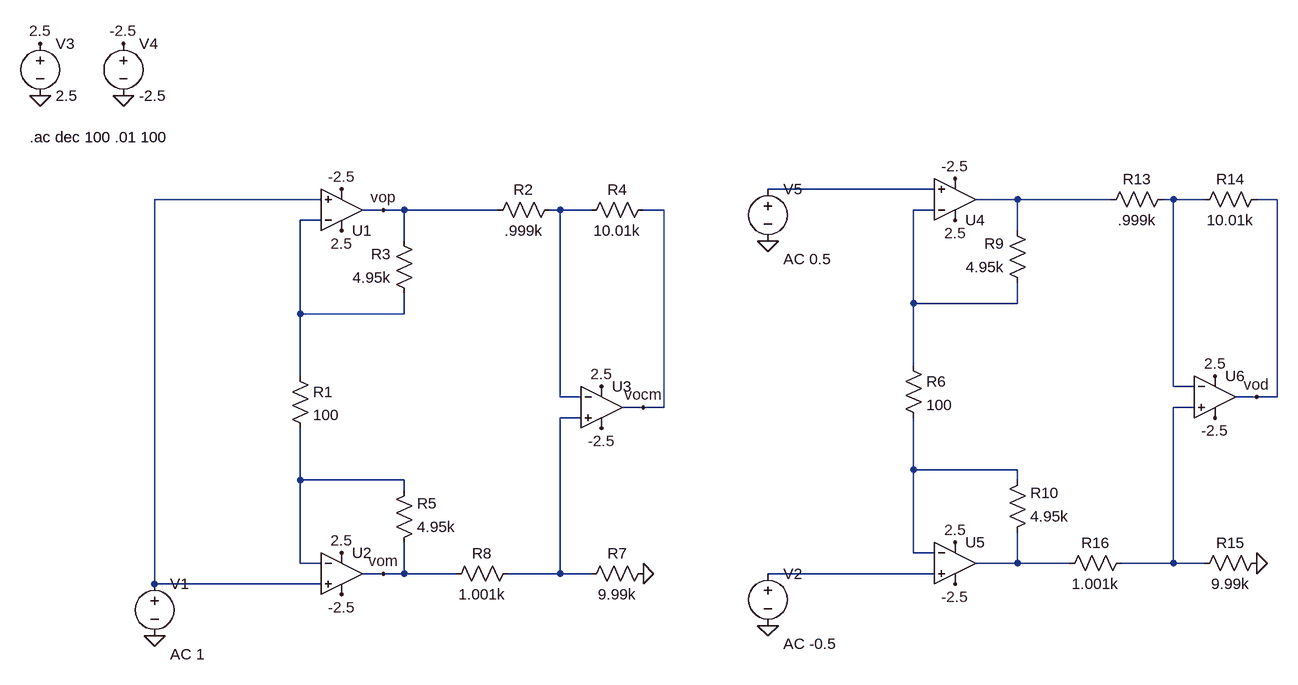
[diagram p0: schematic in_amp.asc]
in_amp.asc, the LTspice schematic file:
Version 4
SHEET 1 1708 880
WIRE 1168 128 912 128
WIRE 224 144 -32 144
WIRE 1296 144 1232 144
WIRE 1440 144 1296 144
WIRE 1536 144 1520 144
WIRE 1584 144 1536 144
WIRE 1696 144 1664 144
WIRE 320 160 288 160
WIRE 352 160 320 160
WIRE 496 160 352 160
WIRE 592 160 576 160
WIRE 640 160 592 160
WIRE 752 160 720 160
WIRE 1168 160 1136 160
WIRE 224 176 192 176
WIRE 1296 192 1296 144
WIRE 352 208 352 160
WIRE 1136 304 1136 160
WIRE 1296 304 1296 272
WIRE 1296 304 1136 304
WIRE 192 320 192 176
WIRE 352 320 352 288
WIRE 352 320 192 320
WIRE 1136 400 1136 304
WIRE 192 416 192 320
WIRE 1536 432 1536 144
WIRE 1568 432 1536 432
WIRE 592 448 592 160
WIRE 624 448 592 448
WIRE 1664 448 1632 448
WIRE 1696 448 1696 144
WIRE 1696 448 1664 448
WIRE 720 464 688 464
WIRE 752 464 752 160
WIRE 752 464 720 464
WIRE 1568 464 1536 464
WIRE 624 480 592 480
WIRE 1136 560 1136 480
WIRE 1296 560 1136 560
WIRE 192 576 192 496
WIRE 352 576 192 576
WIRE 1296 576 1296 560
WIRE 352 592 352 576
WIRE 1136 688 1136 560
WIRE 1168 688 1136 688
WIRE 192 704 192 576
WIRE 224 704 192 704
WIRE 1296 704 1296 656
WIRE 1296 704 1232 704
WIRE 1376 704 1296 704
WIRE 1536 704 1536 464
WIRE 1536 704 1456 704
WIRE 1584 704 1536 704
WIRE 320 720 288 720
WIRE 352 720 352 672
WIRE 352 720 320 720
WIRE 432 720 352 720
WIRE 592 720 592 480
WIRE 592 720 512 720
WIRE 640 720 592 720
WIRE 1168 720 912 720
WIRE -32 736 -32 144
WIRE 224 736 -32 736
FLAG -80 -16 0
FLAG -208 -16 0
FLAG -208 -96 2.5
FLAG -80 -96 -2.5
FLAG 256 192 2.5
FLAG 256 128 -2.5
FLAG 256 688 2.5
FLAG 256 752 -2.5
FLAG 320 160 vop
FLAG 320 720 vom
FLAG -32 816 0
FLAG 720 720 0
FLAG 656 432 2.5
FLAG 656 496 -2.5
FLAG 720 464 vocm
FLAG 1200 176 2.5
FLAG 1200 112 -2.5
FLAG 1200 672 2.5
FLAG 1200 736 -2.5
FLAG 912 800 0
FLAG 1664 704 0
FLAG 1600 416 2.5
FLAG 1600 480 -2.5
FLAG 1664 448 vod
FLAG 912 208 0
SYMBOL Opamps\\UniversalOpamp2 256 160 M180
SYMATTR InstName U1
SYMATTR SpiceModel level.1
SYMATTR Value2 Avol=10Meg GBW=1Meg Slew=10Meg
SYMBOL res 368 304 R180
WINDOW 0 36 76 Left 2
WINDOW 3 36 40 Left 2
SYMATTR InstName R3
SYMATTR Value 4.95k
SYMBOL voltage -208 -112 R0
WINDOW 123 0 0 Left 0
WINDOW 39 0 0 Left 0
SYMATTR InstName V3
SYMATTR Value 2.5
SYMBOL voltage -80 -112 R0
WINDOW 123 0 0 Left 0
WINDOW 39 0 0 Left 0
SYMATTR InstName V4
SYMATTR Value -2.5
SYMBOL Opamps\\UniversalOpamp2 256 720 R0
SYMATTR InstName U2
SYMATTR SpiceModel level.1
SYMATTR Value2 Avol=10Meg GBW=1Meg Slew=10Meg
SYMBOL res 336 688 M180
WINDOW 0 36 76 Left 2
WINDOW 3 36 40 Left 2
SYMATTR InstName R5
SYMATTR Value 4.95k
SYMBOL voltage -32 720 R0
WINDOW 123 24 124 Left 2
WINDOW 39 0 0 Left 0
SYMATTR Value2 AC 1
SYMATTR InstName V1
SYMATTR Value ""
SYMBOL Opamps\\UniversalOpamp2 656 464 R0
SYMATTR InstName U3
SYMATTR SpiceModel level.1
SYMATTR Value2 Avol=10Meg GBW=1Meg Slew=10Meg
SYMBOL res 592 144 R90
WINDOW 0 0 56 VBottom 2
WINDOW 3 32 56 VTop 2
SYMATTR InstName R2
SYMATTR Value .999k
SYMBOL res 736 144 R90
WINDOW 0 0 56 VBottom 2
WINDOW 3 32 56 VTop 2
SYMATTR InstName R4
SYMATTR Value 10.01k
SYMBOL res 736 704 R90
WINDOW 0 0 56 VBottom 2
WINDOW 3 32 56 VTop 2
SYMATTR InstName R7
SYMATTR Value 9.99k
SYMBOL res 416 736 R270
WINDOW 0 32 56 VTop 2
WINDOW 3 0 56 VBottom 2
SYMATTR InstName R8
SYMATTR Value 1.001k
SYMBOL Opamps\\UniversalOpamp2 1200 144 M180
SYMATTR InstName U4
SYMATTR SpiceModel level.1
SYMATTR Value2 Avol=10Meg GBW=1Meg Slew=10Meg
SYMBOL res 1312 288 R180
WINDOW 0 36 76 Left 2
WINDOW 3 36 40 Left 2
SYMATTR InstName R9
SYMATTR Value 4.95k
SYMBOL Opamps\\UniversalOpamp2 1200 704 R0
SYMATTR InstName U5
SYMATTR SpiceModel level.1
SYMATTR Value2 Avol=10Meg GBW=1Meg Slew=10Meg
SYMBOL res 1280 672 M180
WINDOW 0 36 76 Left 2
WINDOW 3 36 40 Left 2
SYMATTR InstName R10
SYMATTR Value 4.95k
SYMBOL voltage 912 704 R0
WINDOW 123 24 124 Left 2
WINDOW 39 0 0 Left 0
SYMATTR Value2 AC -0.5
SYMATTR InstName V2
SYMATTR Value ""
SYMBOL Opamps\\UniversalOpamp2 1600 448 R0
SYMATTR InstName U6
SYMATTR SpiceModel level.1
SYMATTR Value2 Avol=10Meg GBW=1Meg Slew=10Meg
SYMBOL res 1536 128 R90
WINDOW 0 0 56 VBottom 2
WINDOW 3 32 56 VTop 2
SYMATTR InstName R13
SYMATTR Value .999k
SYMBOL res 1680 128 R90
WINDOW 0 0 56 VBottom 2
WINDOW 3 32 56 VTop 2
SYMATTR InstName R14
SYMATTR Value 10.01k
SYMBOL res 1680 688 R90
WINDOW 0 0 56 VBottom 2
WINDOW 3 32 56 VTop 2
SYMATTR InstName R15
SYMATTR Value 9.99k
SYMBOL res 1360 720 R270
WINDOW 0 32 56 VTop 2
WINDOW 3 0 56 VBottom 2
SYMATTR InstName R16
SYMATTR Value 1.001k
SYMBOL voltage 912 112 R0
WINDOW 123 24 124 Left 2
WINDOW 39 0 0 Left 0
SYMATTR Value2 AC 0.5
SYMATTR InstName V5
SYMATTR Value ""
SYMBOL res 176 400 R0
SYMATTR InstName R1
SYMATTR Value 100
SYMBOL res 1120 384 R0
SYMATTR InstName R6
SYMATTR Value 100
TEXT -224 48 Left 2 !.ac dec 100 .01 100

The netlist it stands for:
* in_amp.asc
XU1 N002 N007 2.5 -2.5 vop level.1 Avol=10Meg GBW=1Meg Slew=10Meg ilimit=25m rail=0 Vos=0 phimargin=45 en=0 enk=0 in=0 ink=0 Rin=500Meg  ; pins IN+ IN- V+ V- OUT
R3 N007 vop 4.95k
V3 2.5 0 2.5
V4 -2.5 0 -2.5
XU2 N002 N011 2.5 -2.5 vom level.1 Avol=10Meg GBW=1Meg Slew=10Meg ilimit=25m rail=0 Vos=0 phimargin=45 en=0 enk=0 in=0 ink=0 Rin=500Meg  ; pins IN+ IN- V+ V- OUT
R5 vom N011 4.95k
V1 N002 0 AC 1
XU3 N009 N005 2.5 -2.5 vocm level.1 Avol=10Meg GBW=1Meg Slew=10Meg ilimit=25m rail=0 Vos=0 phimargin=45 en=0 enk=0 in=0 ink=0 Rin=500Meg  ; pins IN+ IN- V+ V- OUT
R2 N005 vop .999k
R4 vocm N005 10.01k
R7 0 N009 9.99k
R8 vom N009 1.001k
XU4 N001 N006 2.5 -2.5 N003 level.1 Avol=10Meg GBW=1Meg Slew=10Meg ilimit=25m rail=0 Vos=0 phimargin=45 en=0 enk=0 in=0 ink=0 Rin=500Meg  ; pins IN+ IN- V+ V- OUT
R9 N006 N003 4.95k
XU5 N013 N010 2.5 -2.5 N012 level.1 Avol=10Meg GBW=1Meg Slew=10Meg ilimit=25m rail=0 Vos=0 phimargin=45 en=0 enk=0 in=0 ink=0 Rin=500Meg  ; pins IN+ IN- V+ V- OUT
R10 N012 N010 4.95k
V2 N013 0 AC -0.5
XU6 N008 N004 2.5 -2.5 vod level.1 Avol=10Meg GBW=1Meg Slew=10Meg ilimit=25m rail=0 Vos=0 phimargin=45 en=0 enk=0 in=0 ink=0 Rin=500Meg  ; pins IN+ IN- V+ V- OUT
R13 N004 N003 .999k
R14 vod N004 10.01k
R15 0 N008 9.99k
R16 N012 N008 1.001k
V5 N001 0 AC 0.5
R1 N007 N011 100
R6 N006 N010 100
.ac dec 100 .01 100
.lib UniversalOpamps2.sub
.backanno
.end